# Altium project Quadcopter_FC.PrjPcb
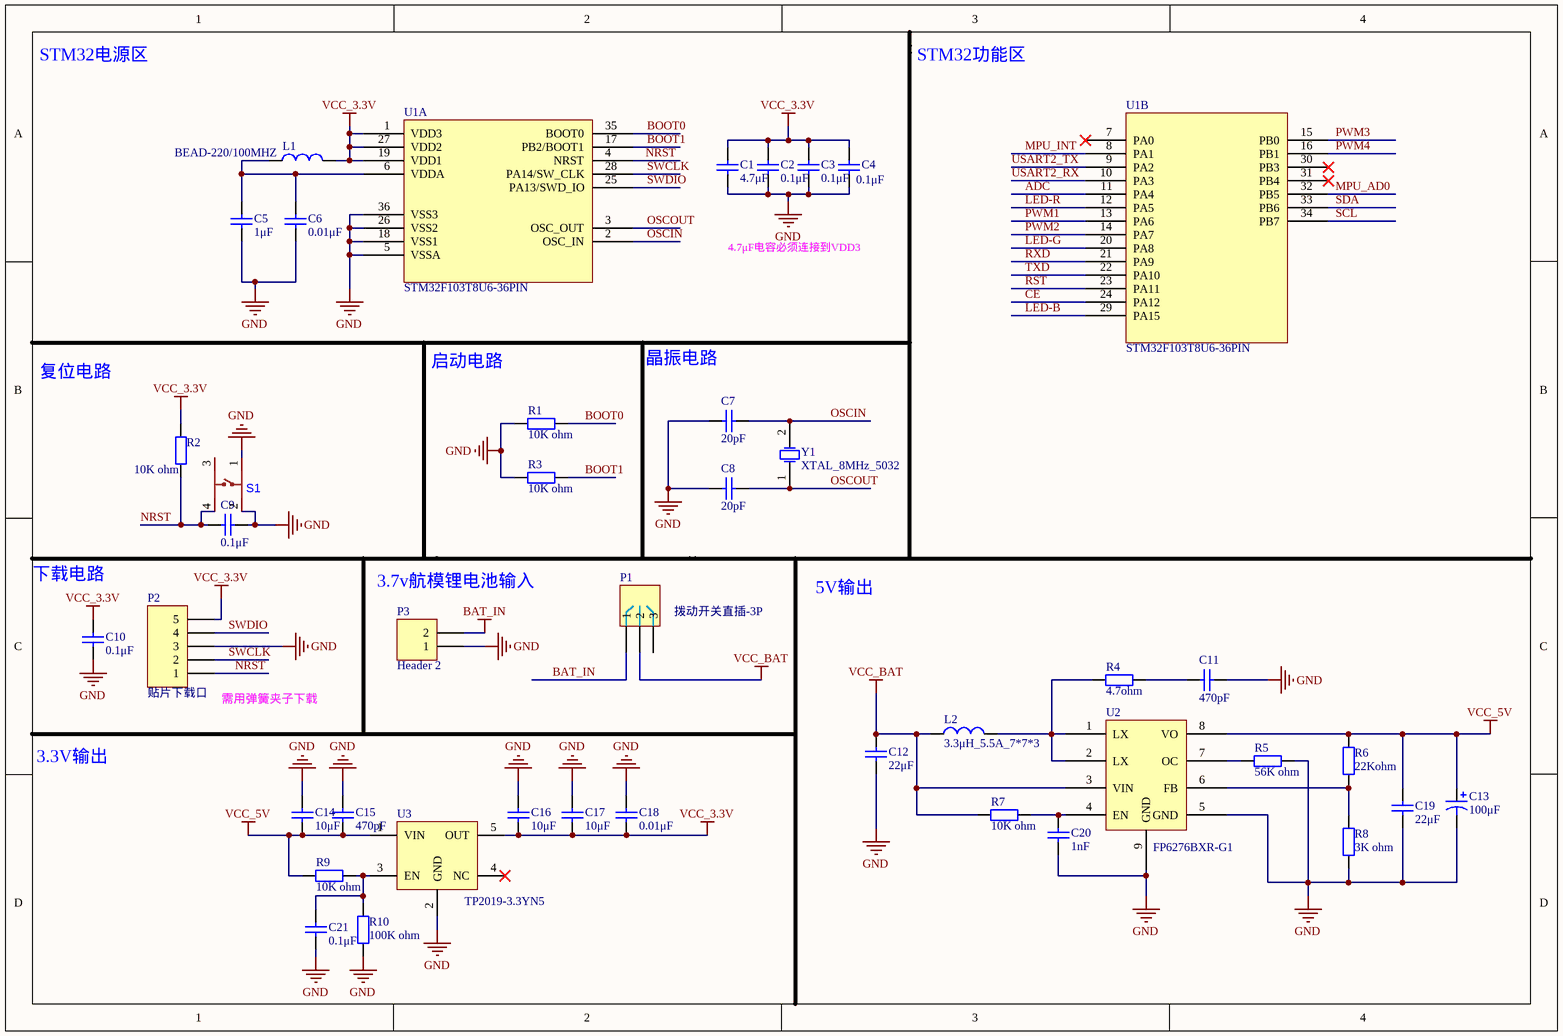
[diagram p0: MCU.SchDoc]
2 sheets, 90 parts. Net scope: global (net labels, ports and power ports of the same name join across sheets).
Board file: Quadcopter_FC.PcbDoc
Sheets:
  MCU.SchDoc
  Module.SchDoc

## Sheet MCU.SchDoc: STM32 Quadcopter Flight Controller
size A4; Revision: 1

### Parts
C1  4.7μF  [0603C]
C2  0.1μF  [0603C]
C3  0.1μF  [0603C]
C4  0.1μF  [0603C]
C5  1μF  [0603C]
C6  0.01μF  [0603C]
C7  20pF  [0603C]
C8  20pF  [0603C]
C9  0.1μF  [0603C]
C10  0.1μF  [0603C]
C11  470pF  [0603C]
C12  22μF  [1206C]
C13  100μF  [D7343C]
C14  10μF  [0603C]
C15  470pF  [0603C]
C16  10μF  [0603C]
C17  10μF  [0603C]
C18  0.01μF  [0603C]
C19  22μF  [1206C]
C20  1nF  [0603C]
C21  0.1μF  [0603C]
L1  BEAD-220/100MHZ  [0603R]
L2  3.3μH_5.5A_7*7*3  [7*7*3mm - 06030]
P1  拨动开关直插-3P  [Switch-3P]
P2  贴片下载口  [download]
P3  Header 2  [HDR1X2]
R1  10K ohm  [0603R]
R2  10K ohm  [0603R]
R3  10K ohm  [0603R]
R4  4.7ohm  [0603R]
R5  56K ohm  [0603R]
R6  22Kohm  [0603R]
R7  10K ohm  [0603R]
R8  3K ohm  [0603R]
R9  10K ohm  [0603R]
R10  100K ohm  [0603R]
S1  BX-TS-26-4416TT  [SW-SMD_4P-L5.2-W5.2-P3.70-LS6.5]  (value not drawn)
U1  STM32F103T8U6-36PIN  [QFN-36N]  (parts A,B of 2)
U2  FP6276BXR-G1  [SO8 - FP6277]
U3  TP2019-3.3YN5  [SOT-23-5]
Y1  XTAL_8MHz_5032  [5032]

### Nets
BAT_IN: P1.1 P3.2
GND: C1.1 C2.1 C3.1 C4.1 C5.1 C6.1 C7.1 C8.1 C9.1 C10.1 C11.1 C12.1 C13.2 C14.1 C15.1 C16.1 C17.2 C18.2 C19.1 C20.2 C21.2 P2.3 P3.1 R1.1 R3.1 R5.2 R8.1 R10.1 S1.1 S1.2 U1.5(VSSA) U1.18(VSS1) U1.26(VSS2) U1.36(VSS3) U2.5(GND) U2.9(GND) U3.2(GND)
VCC_3.3V: C1.2 C2.2 C3.2 C4.2 C10.2 C16.2 C17.1 C18.1 L1.2 P2.5 R2.1 U1.1(VDD3) U1.19(VDD1) U1.27(VDD2) U3.5(OUT)
VCC_5V: C13.1 C14.2 C15.2 C19.2 R6.2 R9.1 U2.8(VO) U3.1(VIN)
VCC_BAT: C12.2 L2.1 P1.2 R7.1 U2.3(VIN)
ADC: U1.11(PA4)
BOOT0: R1.2 U1.35(BOOT0)
BOOT1: R3.2 U1.17(PB2/BOOT1)
CE: U1.24(PA12)
LED-B: U1.29(PA15)
LED-G: U1.20(PA8)
LED-R: U1.12(PA5)
MPU_AD0: U1.32(PB5)
MPU_INT: U1.8(PA1)
NRST: C9.2 P2.1 R2.2 S1.4 U1.4(NRST)
OSCIN: C7.2 U1.2(OSC_IN) Y1.2(OSC2)
OSCOUT: C8.2 U1.3(OSC_OUT) Y1.1(OSC1)
PWM1: U1.13(PA6)
PWM2: U1.14(PA7)
PWM3: U1.15(PB0)
PWM4: U1.16(PB1)
RST: U1.23(PA11)
RXD: U1.21(PA9)
SCL: U1.34(PB7)
SDA: U1.33(PB6)
SWCLK: P2.2 U1.28(PA14/SW_CLK)
SWDIO: P2.4 U1.25(PA13/SWD_IO)
TXD: U1.22(PA10)
USART2_RX: U1.10(PA3)
USART2_TX: U1.9(PA2)
NetC5_2: C5.2 C6.2 L1.1 U1.6(VDDA)
NetC11_2: C11.2 R4.1
NetC20_1: C20.1 R7.2 U2.4(EN)
NetC21_1: C21.1 R9.2 R10.2 U3.3(EN)
NetL2_2: L2.2 R4.2 U2.1(LX) U2.2(LX)
NetR5_1: R5.1 U2.7(OC)
NetR6_1: R6.1 R8.2 U2.6(FB)

Not connected (* = marked no-connect by the designer): P1 3; S1 3; U1 7(PA0)* 30(PB3)* 31(PB4)*; U3 4(NC)*

### Notes on the sheet
- STM32电源区
- STM32功能区
- 4.7μF电容必须连接到VDD3
- 复位电路
- 启动电路
- 晶振电路
- (near C10) 下载电路
- (near P3) 3.7v航模锂电池输入
- 5V输出
- (near P2) 需用弹簧夹子下载
- 3.3V输出

### Library data of the parts
C1-C6 C9 C10 C18 = Cap_0.1μF_50V_0603: 0.1μF_50V,X7R,±5%; 物料名称: 贴片陶瓷电容; 制造商: muRata; 物料编码: TCC0087; 物料型号: GRM188R71H104JA93D; 单位: PCS; 物料规格: 0.1μF_50V,X7R,±5%
C7 C8 = Cap_20pF_50V_0603: 20pF_50V,CH,±5%; 物料名称: 贴片陶瓷电容; 制造商: muRata; 物料编码: TCC0036; 物料型号: GRM1882C1H200JA01D; 单位: PCS; 物料规格: 20pF_50V,CH,±5%
C11 = Cap_2.2nF_50V_0603: 2.2nF_50V,X7R,10%; 物料名称: 贴片陶瓷电容; 制造商: muRata; 物料编码: NA; 单位: PCS; 物料规格: 2.2nF_50V,X7R,10%; 物料型号: NA
C12 C19 = Cap_22μF_35V_1206: 22μF_35V,20%; 物料名称: 贴片陶瓷电容; 制造商: TDK; 物料编码: NA; 物料型号: C3216JB1V226M160AC; 单位: PCS; 物料规格: 22μF_35V,20%
C13 = Cap_100μF_16V_D7343: 100μF_16V; 物料名称: 钽电容; 制造商: AVX; 物料编码: NA; 单位: PCS; 物料规格: 100μF_16V; 物料型号: NA
C14-C16 C20 C21 = Cap_1μF_50V_0603: 1μF_50V,X5R,±10%; 物料名称: 贴片陶瓷电容; 制造商: muRata; 物料编码: TCC0040; 物料型号: GRM188R61H105KAALD; 单位: PCS; 物料规格: 1μF_50V,X5R,±10%
  C20: ComponentLink1Description: New link; ComponentLink1URL: *
C17 = Cap_10μF_35V_0603: 10μF_35V,X5R,20%; 物料规格: 10μF_35V,20%; 物料名称: 贴片陶瓷电容; 制造商: muRata; 物料编码: TCC0071; 物料型号: GRM188R6YA106MA73D; 单位: PCS
L1 = BEAD-220/100MHZ_0603: 物料名称: 磁珠; 制造商: TDK; 物料编码: TCZ0006; 物料型号: MMZ1608B221CTAH0; 单位: PCS; 物料规格: BEAD-220/100MHZ
L2 = 4.7μH_5.5A_7*7*3: 4.7μH_5.5A_; 物料名称: 功率电感; 制造商: 台湾奇力新; 物料编码: NA; 物料型号: MHCC10040-4R7M-R8_06030; 单位: PCS; 物料规格: 4.7μH_5.5A_7*7*3
P1 = 拨动开关直插-3P: 制造商: NA; 单位: PCS; 物料规格: 拨动开关直插-3P; 物料名称: 拨动开关直插-3P; 物料编码: NA; 物料型号: 拨动开关直插-3P
P2 = 微型下载口: 制造商: NA; 单位: PCS; 物料规格: 微型下载口; 物料名称: 微型下载口; 物料编码: NA; 物料型号: 微型下载口
P3 = Header 2: Header, 2-Pin; LatestRevisionDate: 17-Jul-2002; LatestRevisionNote: Re-released for DXP Platform.; Publisher: Altium Limited
R1-R3 R7 R9 R10 = Res_10K ohm_0603: 10K ohm,1%; 物料名称: 贴片电阻; 制造商: YAGEO; 物料编码: TRS0020; 物料型号: RC0603FR-0710KL; 单位: PCS; 物料规格: 10K ohm,1%
R4 = Res_24K ohm_0603: 24K ohm,1%; 物料名称: 贴片电阻; 制造商: YAGEO; 物料编码: NA; 物料型号: RC0603FR-0724KL; 单位: PCS; 物料规格: 24K ohm,1%
R5 = Res_30K ohm_0603: 30K ohm,1%; 物料名称: 贴片电阻; 制造商: YAGEO; 物料编码: TRS0028; 物料型号: RC0603FR-0730KL; 单位: PCS; 物料规格: 30K ohm,1%
R6 = Res_100Kohm_0603: 100K ohm_5%; 物料名称: 贴片电阻; 制造商: YAGEO; 物料编码: TRS0032; 物料型号: RC0603JR-07100K; 单位: PCS; 物料规格: 100K ohm_5%
R8 = Res_13K ohm_0603: 13K ohm,1%; 物料名称: 贴片电阻; 制造商: YAGEO; 单位: PCS; 物料规格: 13K ohm,1%
S1 = BX-TS-26-4416TT: Manufacturer: Bossie(博锡); Add into BOM: yes; Circuit: 单刀单掷; Actuator Style: 圆形按钮; Operating Force: 260gf; Switch Length: 4mm; Switch Height: 1.6mm; Strike Gundam: 不带; Contact Current: 50mA; Voltage Rating (AC): 250V; Voltage Rating (DC): 12V; Insulation Resistance: 100MΩ; Actuator/Cap Color: 金色; Pin Style: 鸥翼型; Mechanical Life: 10万次; Symbol: BX-TS-26-4416TT; Device: BX-TS-26-4416TT; LCSC Part Name: 4x4x1.6铜头开关; Supplier Part: C18078109; Manufacturer Part: BX-TS-26-4416TT; Supplier Footprint: SMD-4P,4x4mm; JLCPCB Part Class: 扩展库; Datasheet: https://atta.szlcsc.com/upload/public/pdf/source/20231017/1BCB02B7989804C2A116E52C6BA77509.pdf; Supplier: LCSC; Convert to PCB: yes; Mounting Style: 立贴; Switch Width: 4mm; Operating Temperature: -30℃~+80℃
U1 = STM32F103T8U6-36PIN: 物料名称: 单片机; 单位: PCS; 制造商: ST; 物料编码: NA; 物料型号: STM32F103T8U6-36PIN; 物料规格: STM32F103T8U6-36PIN
U2 = FP6277: 物料名称: 升压芯片; 制造商: 台湾远翔; 物料编码: NA; 单位: PCS; 物料规格: FP6277; 物料型号: FP6277
U3 = TP2019-3.3YN5: 物料名称: 3.3v电源; 制造商: Tech Public 台舟电子; 物料编码: NA; 单位: PCS; 物料规格: TP2019-3.3YN5; 物料型号: TP2019-3.3YN5
Y1 = XTAL_8MHz_5032: XTAL_8MHz; 物料规格: 8MHz; 物料名称: 晶振; 制造商: TAITIEN; 物料编码: NA; 物料型号: XIHCCCNANF-8.000; 单位: PCS

## Sheet Module.SchDoc
size A4
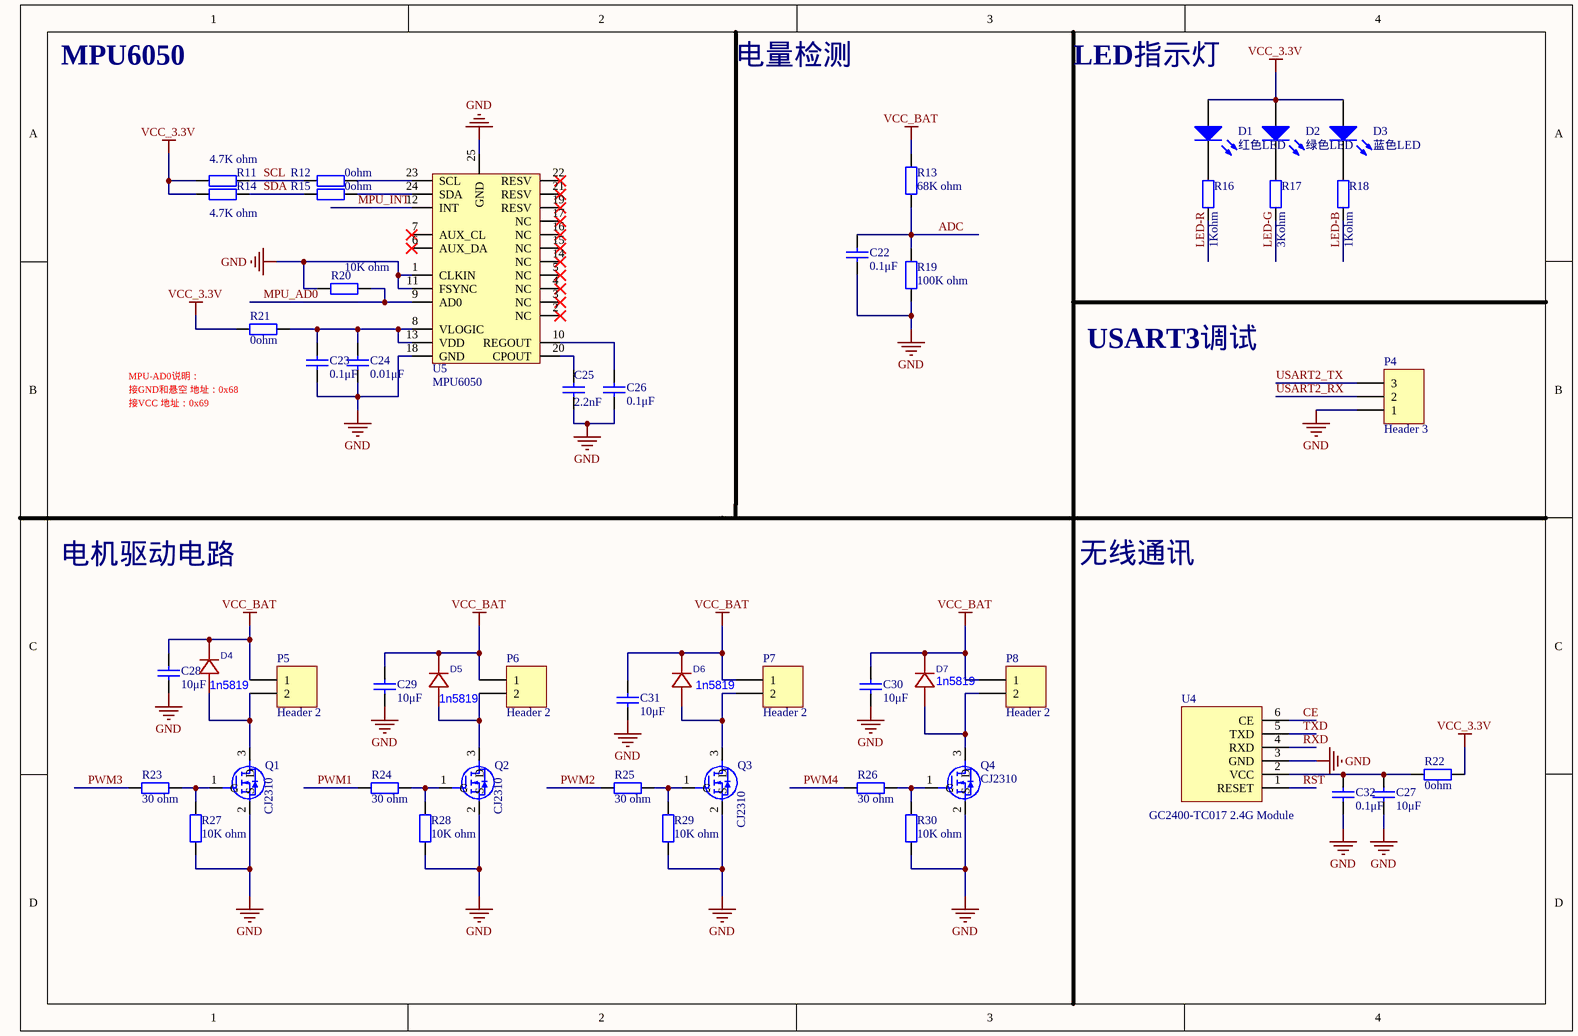
[diagram p1: Module.SchDoc]

### Parts
C22  0.1μF  [0603C]
C23  0.1μF  [0603C]
C24  0.01μF  [0603C]
C25  2.2nF  [0603C]
C26  0.1μF  [0603C]
C27  10μF  [0603C]
C28  10μF  [0603C]
C29  10μF  [0603C]
C30  10μF  [0603C]
C31  10μF  [0603C]
C32  0.1μF  [0603C]
D1  红色LED  [0603LED]
D2  绿色LED  [0603LED]
D3  蓝色LED  [0603LED]
D4  1n5819  [0603R]
D5  1n5819  [0603R]
D6  1n5819  [0603R]
D7  1n5819  [0603R]
P4  Header 3  [HDR1X3]
P5  Header 2  [HDR1X2]
P6  Header 2  [HDR1X2]
P7  Header 2  [HDR1X2]
P8  Header 2  [HDR1X2]
Q1  CJ2310  [SOT23-3]
Q2  CJ2310  [SOT23-3]
Q3  CJ2310  [SOT23-3]
Q4  CJ2310  [SOT23-3]
R11  4.7K ohm  [0603R]
R12  0ohm  [0603R]
R13  68K ohm  [0603R]
R14  4.7K ohm  [0603R]
R15  0ohm  [0603R]
R16  1Kohm  [0603R]
R17  3Kohm  [0603R]
R18  1Kohm  [0603R]
R19  100K ohm  [0603R]
R20  10K ohm  [0603R]
R21  0ohm  [0603R]
R22  0ohm  [0603R]
R23  30 ohm  [0603R]
R24  30 ohm  [0603R]
R25  30 ohm  [0603R]
R26  30 ohm  [0603R]
R27  10K ohm  [0603R]
R28  10K ohm  [0603R]
R29  10K ohm  [0603R]
R30  10K ohm  [0603R]
U4  GC2400-TC017 2.4G Module  [2.4G-Serial port]
U5  MPU6050  [QFN24]

### Nets
GND: C22.1 C23.1 C24.1 C25.1 C26.1 C27.1 C28.1 C29.1 C30.1 C31.1 C32.1 P4.1 Q1.2(S) Q2.2(S) Q3.2(S) Q4.2(S) R19.1 R20.1 R27.1 R28.1 R29.1 R30.1 U4.3(GND) U5.1(CLKIN) U5.11(FSYNC) U5.18(GND) U5.25(GND)
VCC_3.3V: D1.1(A) D2.1(A) D3.1(A) R11.1 R14.1 R21.2 R22.1
VCC_BAT: C28.2 C29.2 C30.2 C31.2 D4.1(K) D5.1(K) D6.1(K) D7.1(K) P5.1 P6.1 P7.1 P8.1 R13.2
ADC: C22.2 R13.1 R19.2
CE: U4.6(CE)
LED-B: R18.1
LED-G: R17.1
LED-R: R16.1
MPU_AD0: R20.2 U5.9(AD0)
MPU_INT: U5.12(INT)
PWM1: R24.1
PWM2: R25.1
PWM3: R23.1
PWM4: R26.1
RST: U4.1(RESET)
RXD: U4.4(RXD)
SCL: R11.2 R12.1
SDA: R14.2 R15.1
TXD: U4.5(TXD)
USART2_RX: P4.2
USART2_TX: P4.3
NetC23_2: C23.2 C24.2 R21.1 U5.8(VLOGIC) U5.13(VDD)
NetC25_2: C25.2 U5.20(CPOUT)
NetC26_2: C26.2 U5.10(REGOUT)
NetC27_2: C27.2 C32.2 R22.2 U4.2(VCC)
NetD1_2: D1.2(K) R16.2
NetD2_2: D2.2(K) R17.2
NetD3_2: D3.2(K) R18.2
NetD4_2: D4.2(A) P5.2 Q1.3(D)
NetD5_2: D5.2(A) P6.2 Q2.3(D)
NetD6_2: D6.2(A) P7.2 Q3.3(D)
NetD7_2: D7.2(A) P8.2 Q4.3(D)
NetQ1_1: Q1.1(G) R23.2 R27.2
NetQ2_1: Q2.1(G) R24.2 R28.2
NetQ3_1: Q3.1(G) R25.2 R29.2
NetQ4_1: Q4.1(G) R26.2 R30.2
NetR12_2: R12.2 U5.23(SCL)
NetR15_2: R15.2 U5.24(SDA)

Not connected (* = marked no-connect by the designer): U5 2(NC)* 3(NC)* 4(NC)* 5(NC)* 6(AUX_DA)* 7(AUX_CL)* 14(NC)* 15(NC)* 16(NC)* 17(NC)* 19(RESV)* 21(RESV)* 22(RESV)*

### Notes on the sheet
- MPU6050
- 电量检测
- LED指示灯
- MPU-AD0说明：
- USART3调试
- 接GND和悬空 地址：0x68
- 接VCC 地址：0x69
- 电机驱动电路
- 无线通讯

### Library data of the parts
C22-C24 C26 C32 = Cap_0.1μF_50V_0603: as C1 on sheet MCU; 物料规格: 0.1μF_50V,X7R,±5%
C25 C27 = Cap_10μF_35V_0603: as C17 on sheet MCU
C28-C31 = Cap_4.7μF_50V_0603: 4.7μF_50V,±10%; 物料名称: 贴片陶瓷电容; 制造商: TDK; 物料编码: NA; 单位: PCS; 物料规格: 4.7μF_50V,±10%; 物料型号: NA
D1-D3 = 蓝色LED: 物料规格: LED(蓝色）; 制造商: VISHAY; 物料编码: TRG0035; 物料型号: TLMB1100; 单位: PCS; 物料名称: LED(蓝色）
D4-D7 = 1n5819wt_c5451630: 二极管配置:独立式;正向压降(Vf):600mV@200mA;直流反向耐压(Vr):40V;整流电流:350mA;; Manufacturer: HXY MOSFET(华轩阳电子); AddInBom: yes; ModelId: 8f56a03db567494d8f4c9d12aa52a741; ModelName: SOD-523_L1.2-W0.8-H0.7-LS1.6; ModelTransform: 62.992,31.496,0,180,0,0,0,0,0; Diode Configuration: 独立式; Voltage - DC Reverse(Vr): 40V; Current - Rectified: 350mA; Reverse Leakage Current (Ir): 5uA@30V; Symbol: 1N5819WT_C5451630; LCSC Part Name: 电压:40V 电流:350mA; SupplierPart: C5451630; ManufacturerPart: 1N5819WT; Supplier Footprint: SOD-523; JLCPCB Part Class: Extended Part; Datasheet: https://item.szlcsc.com/datasheet/1N5819WT/6355373.html; Supplier: LCSC; ConvertToPcb: yes; FootprintName: SOD-523_L1.2-W0.8-LS1.6-RD; Voltage - Forward(Vf@If): 600mV@200mA
P4 = Header 3: Header, 3-Pin; LatestRevisionDate: 17-Jul-2002; LatestRevisionNote: Re-released for DXP Platform.; Publisher: Altium Limited
P5-P8 = Header 2: Header, 2-Pin; LatestRevisionDate: 17-Jul-2002; LatestRevisionNote: Re-released for DXP Platform.; Publisher: Altium Limited
Q1-Q4 = CJ2310: 物料名称: NMOS; 制造商: JSCJ; 物料编码: NA; 单位: PCS; 物料规格: CJ2310; 物料型号: CJ2310
R11 R14 = Res_4.7K ohm_0603: 4.7K ohm,1%; 物料名称: 贴片电阻; 制造商: YAGEO; 物料型号: AA0603FR-074K7L; 单位: PCS; 物料规格: 4.7K ohm,1%
R12 R15 = Res_120ohm_0603: 120 ohm_5%; 物料名称: 贴片电阻; 制造商: YAGEO; 物料编码: NA; 单位: PCS; 物料规格: 120 ohm_5%; 物料型号: NA
R13 = Res_200K ohm_0603: 200K ohm,1%; 物料名称: 贴片电阻; 制造商: YAGEO; 物料编码: TRS0060; 物料型号: RC0603FR-07200KL; 单位: PCS; 物料规格: 200K ohm,1%
R16-R18 = Res_510ohm_0603: 510 ohm,1%; 物料名称: 贴片电阻; 制造商: YAGEO; 单位: PCS; 物料规格: 510 ohm,1%
R19 = Res_68K ohm_0603: 68K ohm,1%; 物料名称: 贴片电阻; 制造商: YAGEO; 物料编码: NA; 物料型号: RC0603FR-0768KL; 单位: PCS; 物料规格: 68K ohm,1%
R20 R27-R30 = Res_10K ohm_0603: as R1 on sheet MCU; 物料规格: 10K ohm,1%
R21 R22 = Res_24K ohm_0603: as R4 on sheet MCU; 物料规格: 24K ohm,1%
R23-R26 = Res_100ohm_0603: 100 ohm_5%; 物料名称: 贴片电阻; 制造商: YAGEO; 物料编码: TRS0010; 物料型号: RC0603JR-07100R; 单位: PCS; 物料规格: 100 ohm_5%
U4 = 2.4G_转串口: 制造商: NA; 单位: PCS; 物料规格: 2.4G_转串口; 物料名称: 2.4G_转串口; 物料编码: NA; 物料型号: 2.4G_转串口
U5 = MPU6050: 物料名称: 陀螺仪; 制造商: InvenSense; 物料编码: NA; 单位: PCS; 物料规格: MPU6050; 物料型号: MPU6050

## Nets that join several sheets
GND: MCU (37 pins), Module (27 pins)
VCC_3.3V: MCU (15 pins), Module (7 pins)
VCC_BAT: MCU (5 pins), Module (13 pins)
ADC: MCU (U1.11), Module (C22.2 R13.1 R19.2)
CE: MCU (U1.24), Module (U4.6)
LED-B: MCU (U1.29), Module (R18.1)
LED-G: MCU (U1.20), Module (R17.1)
LED-R: MCU (U1.12), Module (R16.1)
MPU_AD0: MCU (U1.32), Module (R20.2 U5.9)
MPU_INT: MCU (U1.8), Module (U5.12)
PWM1: MCU (U1.13), Module (R24.1)
PWM2: MCU (U1.14), Module (R25.1)
PWM3: MCU (U1.15), Module (R23.1)
PWM4: MCU (U1.16), Module (R26.1)
RST: MCU (U1.23), Module (U4.1)
RXD: MCU (U1.21), Module (U4.4)
SCL: MCU (U1.34), Module (R11.2 R12.1)
SDA: MCU (U1.33), Module (R14.2 R15.1)
TXD: MCU (U1.22), Module (U4.5)
USART2_RX: MCU (U1.10), Module (P4.2)
USART2_TX: MCU (U1.9), Module (P4.3)